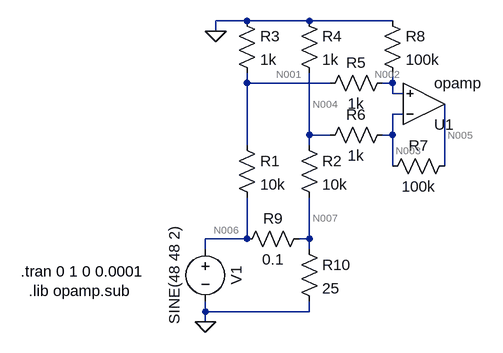
[diagram p0: schematic Draft1.asc]
Draft1.asc, the LTspice schematic file:
Version 4
SHEET 1 880 680
WIRE -80 -32 -128 -32
WIRE 16 -32 -80 -32
WIRE 144 -32 16 -32
WIRE -128 -16 -128 -32
WIRE -80 64 -80 48
WIRE 48 64 -80 64
WIRE 144 64 144 48
WIRE 144 64 128 64
WIRE 144 80 144 64
WIRE 160 80 144 80
WIRE 160 112 144 112
WIRE 16 144 16 48
WIRE 48 144 16 144
WIRE 144 144 144 112
WIRE 144 144 128 144
WIRE -80 160 -80 64
WIRE 16 160 16 144
WIRE 144 192 144 144
WIRE 224 192 224 96
WIRE -80 304 -80 240
WIRE -80 304 -144 304
WIRE 16 304 16 240
WIRE 16 304 0 304
WIRE -144 320 -144 304
WIRE 16 320 16 304
WIRE -144 416 -144 400
WIRE 16 416 16 400
WIRE 16 416 -144 416
WIRE -144 432 -144 416
FLAG -128 -16 0
FLAG -144 432 0
SYMBOL OpAmps\\opamp 192 160 M180
SYMATTR InstName U1
SYMBOL res -96 144 R0
SYMATTR InstName R1
SYMATTR Value 10k
SYMBOL res 0 144 R0
SYMATTR InstName R2
SYMATTR Value 10k
SYMBOL res -96 -48 R0
SYMATTR InstName R3
SYMATTR Value 1k
SYMBOL res 0 -48 R0
SYMATTR InstName R4
SYMATTR Value 1k
SYMBOL res 144 48 R90
WINDOW 0 0 56 VBottom 2
WINDOW 3 32 56 VTop 2
SYMATTR InstName R5
SYMATTR Value 1k
SYMBOL res 144 128 R90
WINDOW 0 0 56 VBottom 2
WINDOW 3 32 56 VTop 2
SYMATTR InstName R6
SYMATTR Value 1k
SYMBOL res 240 176 R90
WINDOW 0 0 56 VBottom 2
WINDOW 3 32 56 VTop 2
SYMATTR InstName R7
SYMATTR Value 100k
SYMBOL res 128 -48 R0
SYMATTR InstName R8
SYMATTR Value 100k
SYMBOL voltage -144 304 R0
WINDOW 0 32 56 VTop 2
WINDOW 3 -32 56 VBottom 2
WINDOW 123 0 0 Left 0
WINDOW 39 0 0 Left 0
SYMATTR InstName V1
SYMATTR Value SINE(48 48 2)
SYMBOL res 16 288 R90
WINDOW 0 0 56 VBottom 2
WINDOW 3 32 56 VTop 2
SYMATTR InstName R9
SYMATTR Value 0.1
SYMBOL res 0 304 R0
SYMATTR InstName R10
SYMATTR Value 25
TEXT -428 354 Left 2 !.tran 0 1 0 0.0001
TEXT -416 384 Left 2 !.lib opamp.sub

The netlist it stands for:
* Draft1.asc
XU1 N003 N002 N005 opamp Aol=100K GBW=10Meg  ; pins invin noninvin out
R1 N001 N006 10k
R2 N004 N007 10k
R3 0 N001 1k
R4 0 N004 1k
R5 N002 N001 1k
R6 N003 N004 1k
R7 N005 N003 100k
R8 0 N002 100k
V1 N006 0 SINE(48 48 2)
R9 N007 N006 0.1
R10 N007 0 25
.tran 0 1 0 0.0001
.lib opamp.sub
.backanno
.end

* Results of the author's LTspice run, read from the files saved beside the schematic
* Operating Point, zero values left out:
*   V(n005) = 912.2 mV
*   V(n002) = 4.282 V
*   V(n003) = 4.282 V
*   V(n001) = 4.325 V
*   V(n006) = 48 V
*   V(n004) = 4.316 V
*   V(n007) = 47.81 V
*   I(R1) = -4.368 mA
*   I(R2) = -4.349 mA
*   I(R3) = -4.325 mA
*   I(R4) = -4.316 mA
*   I(R5) = -42.82 µA
*   I(R6) = -33.7 µA
*   I(R7) = -33.7 µA
*   I(R8) = -42.82 µA
*   I(R9) = -1.917 A
*   I(R10) = 1.912 A
*   I(V1) = -1.921 A
*   Ix(u1:3) = 33.7 µA
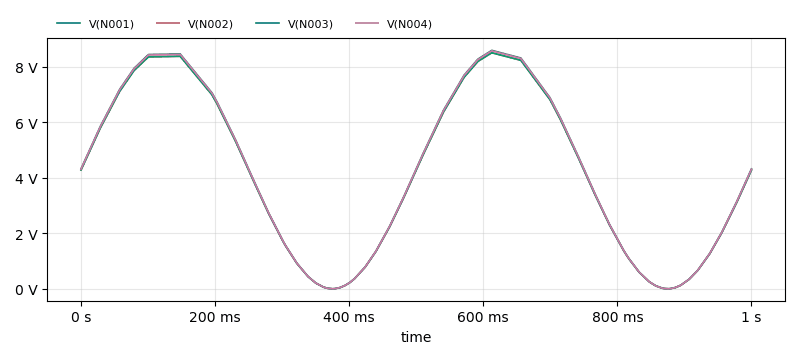
[diagram p1: Transient Analysis of Draft1.asc, plotted from the saved traces]
* Transient Analysis, 1 run:
*   V(N001): min 2.037 µV, max 8.597 V, average 4.304 V, rms 5.276 V, last 4.325 V
*   V(N002): min 2.017 µV, max 8.512 V, average 4.261 V, rms 5.224 V, last 4.282 V
*   V(N003): min 2.017 µV, max 8.512 V, average 4.261 V, rms 5.224 V, last 4.282 V
*   V(N004): min 2.033 µV, max 8.579 V, average 4.295 V, rms 5.265 V, last 4.316 V